# Altium schematic sheet Main.SchDoc
size A3; SheetNumber: 1; SheetTotal: 17
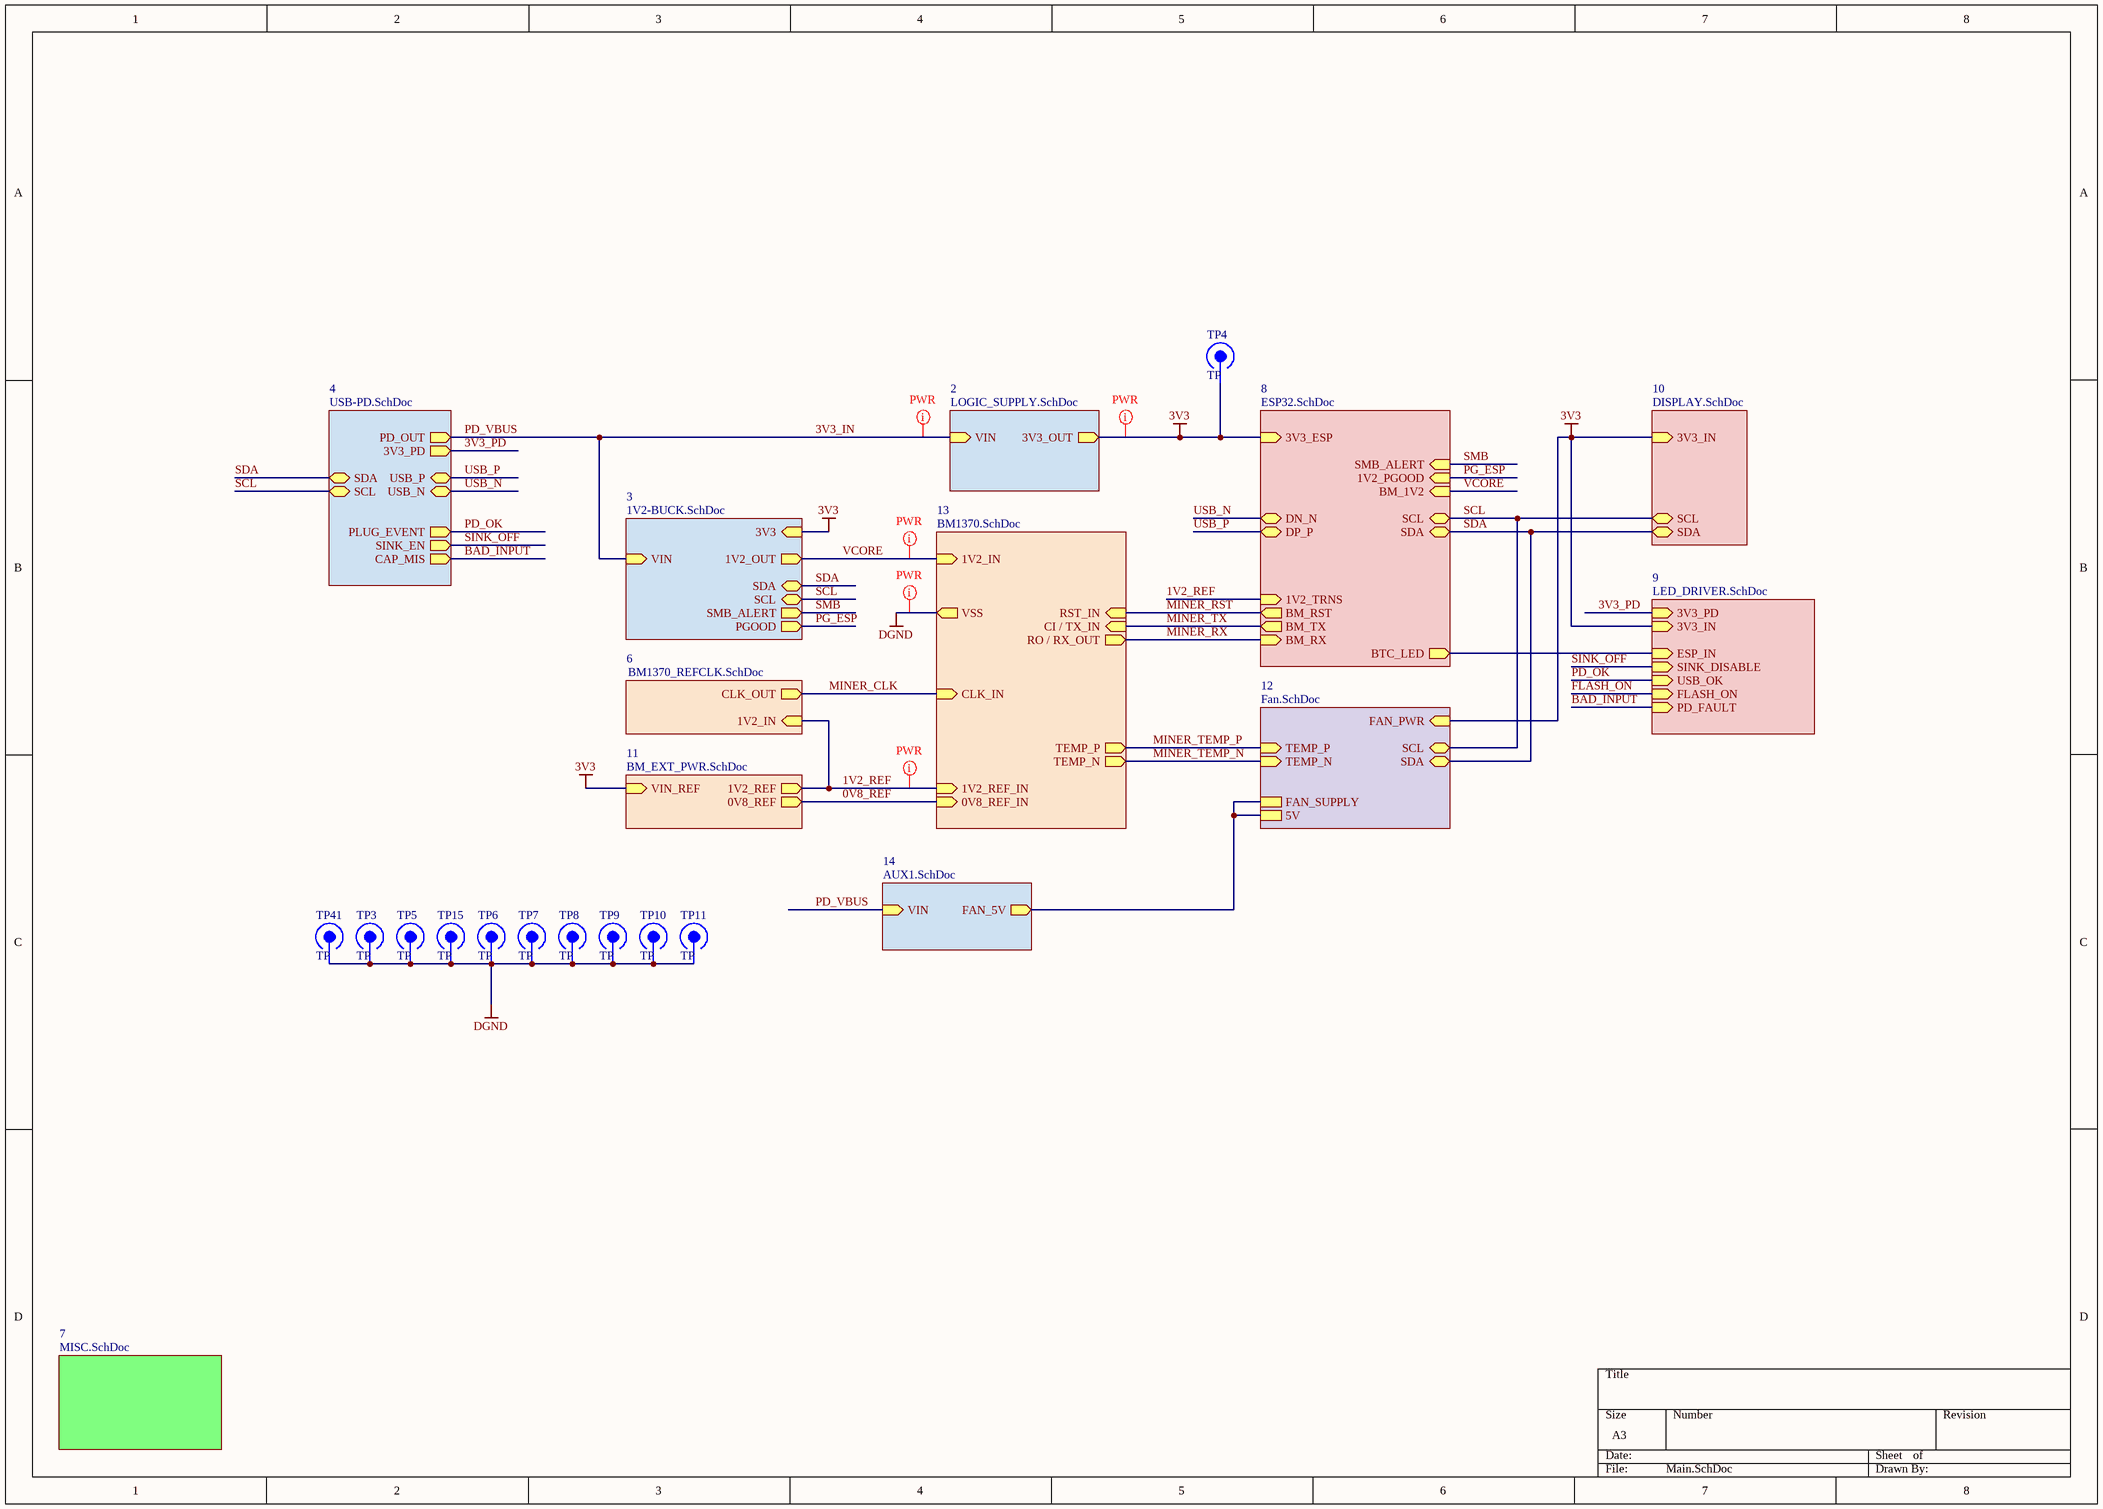
[diagram p0: Main.SchDoc]

## Parts
TP3  TP  [TP-Footprint-1]
TP4  TP  [TP-Footprint-1]
TP5  TP  [TP-Footprint-1]
TP6  TP  [TP-Footprint-1]
TP7  TP  [TP-Footprint-1]
TP8  TP  [TP-Footprint-1]
TP9  TP  [TP-Footprint-1]
TP10  TP  [TP-Footprint-1]
TP11  TP  [TP-Footprint-1]
TP15  TP  [TP-Footprint-1]
TP41  TP  [TP-Footprint-1]

## Sub-sheets
2 = LOGIC_SUPPLY.SchDoc: VIN (in), 3V3_OUT (out)
3 = 1V2-BUCK.SchDoc: VIN (in), 1V2_OUT (out), SDA (bidir), SCL (bidir), SMB_ALERT (out), 3V3 (in), PGOOD (out)
4 = USB-PD.SchDoc: PD_OUT (out), USB_P (bidir), USB_N (bidir), PLUG_EVENT (out), SINK_EN (out), CAP_MIS (out), SDA (bidir), SCL (bidir), 3V3_PD (out)
6 = BM1370_REFCLK.SchDoc: 1V2_IN (in), CLK_OUT (out)
7 = MISC.SchDoc: no entries
8 = ESP32.SchDoc: 3V3_ESP (in), DN_N (bidir), DP_P (bidir), 1V2_PGOOD (in), BM_1V2 (in), SCL (bidir), SDA (bidir), 1V2_TRNS (in), BM_RST (out), BM_TX (out), BM_RX (in), BTC_LED (out), SMB_ALERT (in)
9 = LED_DRIVER.SchDoc: 3V3_IN (in), ESP_IN (in), SINK_DISABLE (in), USB_OK (in), FLASH_ON (in), PD_FAULT (in), 3V3_PD (in)
10 = DISPLAY.SchDoc: 3V3_IN (in), SCL (bidir), SDA (bidir)
11 = BM_EXT_PWR.SchDoc: VIN_REF (in), 1V2_REF (out), 0V8_REF (out)
12 = Fan.SchDoc: SCL (bidir), SDA (bidir), TEMP_P (in), TEMP_N (in), FAN_PWR (in), FAN_SUPPLY, 5V
13 = BM1370.SchDoc: 1V2_REF_IN (in), 0V8_REF_IN (in), 1V2_IN (in), VSS (out), RST_IN (in), CI / TX_IN (in), RO / RX_OUT (out), TEMP_P (out), TEMP_N (out), CLK_IN (in)
14 = AUX1.SchDoc: VIN (in), FAN_5V (out)

## Nets
3V3: TP4.1 ; sheet 3/3V3, sheet 12/FAN_PWR, sheet 11/VIN_REF, sheet 8/3V3_ESP, sheet 2/3V3_OUT, sheet 10/3V3_IN, sheet 9/3V3_IN
DGND: TP3.1 TP5.1 TP6.1 TP7.1 TP8.1 TP9.1 TP10.1 TP11.1 TP15.1 TP41.1 ; sheet 13/VSS
0V8_REF: sheet 13/0V8_REF_IN, sheet 11/0V8_REF
1V2_REF: sheet 13/1V2_REF_IN, sheet 11/1V2_REF, sheet 6/1V2_IN, sheet 8/1V2_TRNS
3V3_IN: sheet 3/VIN, sheet 4/PD_OUT, sheet 2/VIN, sheet 14/VIN  [also labelled PD_VBUS]
3V3_PD: sheet 4/3V3_PD, sheet 9/3V3_PD
BAD_INPUT: sheet 4/CAP_MIS, sheet 9/PD_FAULT
FLASH_ON: sheet 9/FLASH_ON
MINER_CLK: sheet 13/CLK_IN, sheet 6/CLK_OUT
MINER_RST: sheet 13/RST_IN, sheet 8/BM_RST
MINER_RX: sheet 13/RO / RX_OUT, sheet 8/BM_RX
MINER_TEMP_N: sheet 13/TEMP_N, sheet 12/TEMP_N
MINER_TEMP_P: sheet 13/TEMP_P, sheet 12/TEMP_P
MINER_TX: sheet 13/CI / TX_IN, sheet 8/BM_TX
PD_OK: sheet 4/PLUG_EVENT, sheet 9/USB_OK
PG_ESP: sheet 3/PGOOD, sheet 8/1V2_PGOOD
SCL: sheet 3/SCL, sheet 12/SCL, sheet 4/SCL, sheet 8/SCL, sheet 10/SCL
SDA: sheet 3/SDA, sheet 12/SDA, sheet 4/SDA, sheet 8/SDA, sheet 10/SDA
SINK_OFF: sheet 4/SINK_EN, sheet 9/SINK_DISABLE
SMB: sheet 3/SMB_ALERT, sheet 8/SMB_ALERT
USB_N: sheet 4/USB_N, sheet 8/DN_N
USB_P: sheet 4/USB_P, sheet 8/DP_P
VCORE: sheet 3/1V2_OUT, sheet 13/1V2_IN, sheet 8/BM_1V2
(unnamed): sheet 12/FAN_SUPPLY, sheet 12/5V, sheet 14/FAN_5V
(unnamed): sheet 8/BTC_LED, sheet 9/ESP_IN

## Layout directives
net class PWR: 1V2_REF, 3V3, 3V3_IN, DGND, VCORE

## Library data of the parts
TP3-TP11 TP15 TP41 = CMP-001-0086-4: digital shovel test point